# EAGLE design SparkFun_adapter-ssop8-v10 (EAGLE 7.2.0)
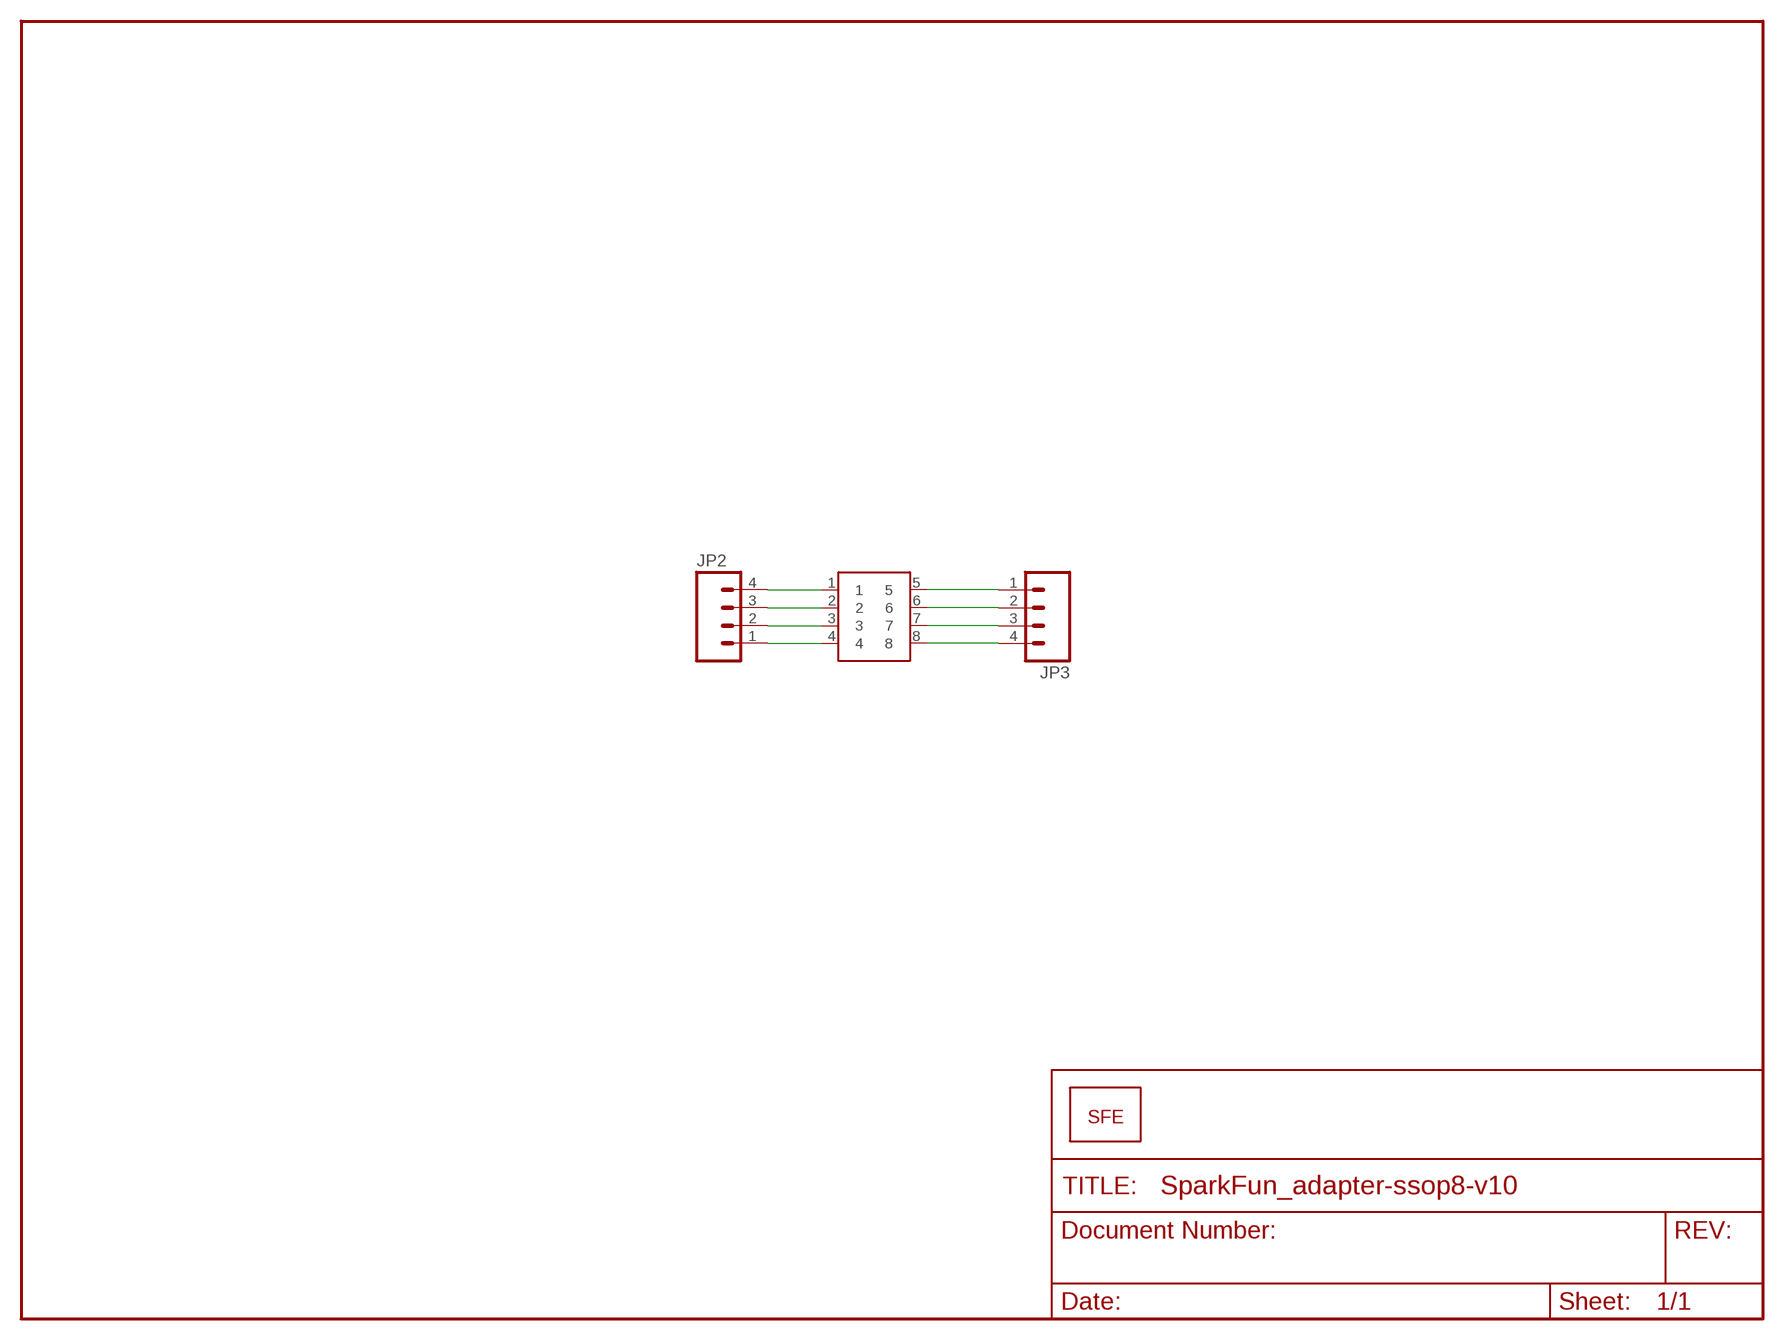
[diagram p0: schematic, sheet 1]

## Parts
JP1  LOGO-SFESK  [SFE-LOGO-FLAME]
JP2  M04PTH  [1X04]
JP3  M04PTH  [1X04]
U$1  SSOP8  [SSOP8]

## Nets
N$1: JP2.1 U$1.4
N$2: JP2.2 U$1.3
N$3: JP2.3 U$1.2
N$4: JP2.4 U$1.1
N$5: JP3.1 U$1.5
N$6: JP3.2 U$1.6
N$7: JP3.3 U$1.7
N$8: JP3.4 U$1.8

## Library data of the parts
JP1 = SparkFun:LOGO-SFE: Spark Fun Electronics PCB Logo This is the standard Spark Fun Electronics PCB logo.
JP2 JP3 = SparkFun:M04: Header 4 Standard 4-pin 0.1" header. Use with straight break away headers (SKU : PRT-00116), right angle break away headers (PRT-00553), swiss pins (PRT-00743), machine pins (PRT-00117), and female headers (PRT-00115). Molex polarized connector foot print use with SKU : PRT-08231 with associated crimp pins and housings. 1MM SMD Version SKU: PRT-10208
U$1 = SparkFun:SSOP8

## Board
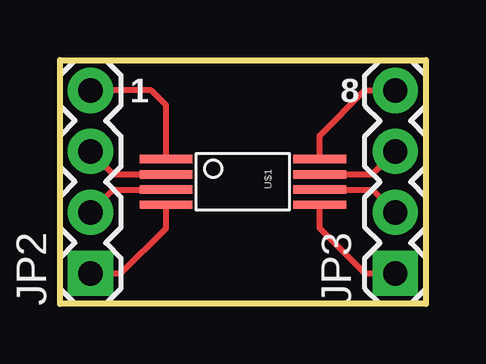
[diagram p1: board, top side]
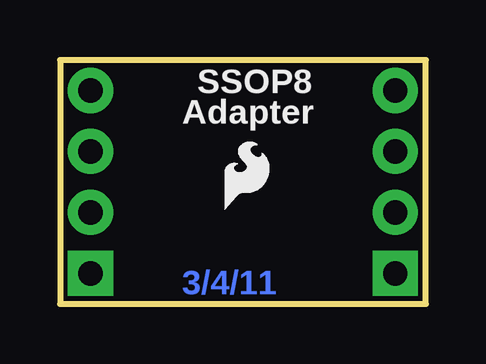
[diagram p2: board, bottom side, seen from below]

Size 15.24 x 10.16 mm. Coordinates in mm from the lower left corner, seen from the top.
Outline: 0,0 0,10.16 15.24,10.16 15.24,0 0,0
Copper layers (1*16): Top 0.0356mm / dielectric 1.5011mm / Bottom 0.0356mm
Design rules "default": minimum track width 8mil, minimum drill 20mil, track to track 8mil, track to pad 8mil, pad to pad 8mil, via to via 8mil, smd to smd 8mil, copper to edge 10mil, drill to drill 8mil, minimum pad ring 12mil, minimum via ring 10mil, stop-mask expansion 4mil, vias tented up to drill 20mil, thermal gap 10mil

### Footprints (pad centres in the part's own frame; a part is rotated, then mirrored left to right if it is on the bottom)
1X04 = drill 1.016 pad 1.88 square: 1 0,0 | drill 1.016 pad 1.88: 2 2.54,0; 3 5.08,0; 4 7.62,0
SSOP8 = smd 0.35 x 2.2: 1 -0.953,-3.2; 2 -0.318,-3.2; 3 0.318,-3.2; 4 0.953,-3.2; 5 0.953,3.2; 6 0.318,3.2; 7 -0.318,3.2; 8 -0.953,3.2

### Placement (x,y rotation side)
JP1  8.38,3.94 0 bottom
JP2  1.27,1.27 90 top
JP3  13.97,1.27 90 top
U$1  7.62,5.08 270 top

### Tracks (layer width: path | path; a pad name or v marks a point on that pad's centre or on a via)
N$1
  Top 0.254: U$1.4 4.42,3.15 2.54,1.27 JP2.1
N$2
  Top 0.254: U$1.3 2.22,4.76 JP2.2
N$3
  Top 0.254: U$1.2 2.22,5.4 JP2.3
N$4
  Top 0.254: U$1.1 4.42,8.28 3.81,8.89 JP2.4
N$5
  Top 0.254: U$1.5 10.82,3.15 12.7,1.27 JP3.1
N$6
  Top 0.254: U$1.6 13.02,4.76 JP3.2
N$7
  Top 0.254: U$1.7 13.02,5.4 JP3.3
N$8
  Top 0.254: U$1.8 10.82,7.01 12.7,8.89 JP3.4

### Text on the board
Bottom: 3/4/11
tPlace: 1 | 8
bPlace: SSOP8 | Adapter